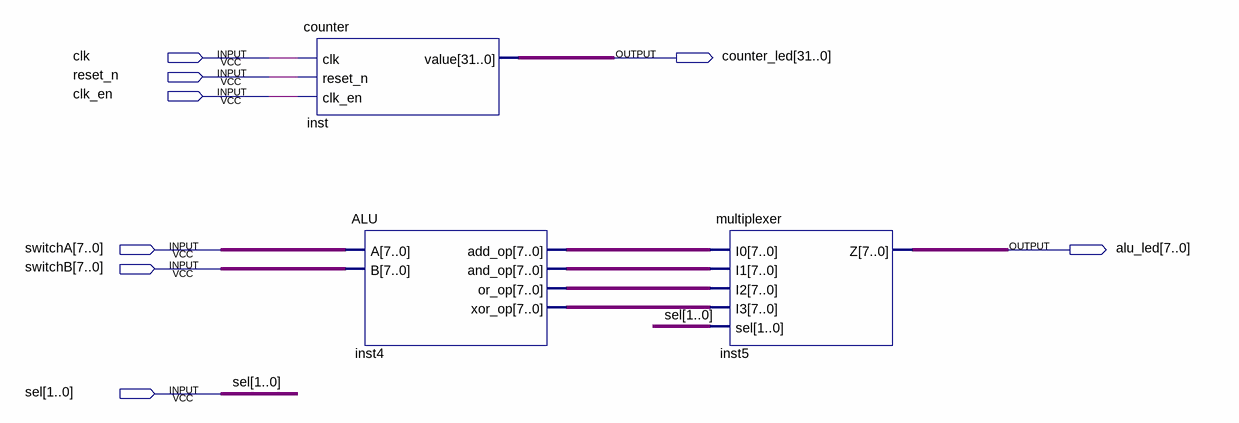
[diagram p0: schematic sheet]
// Quartus schematic Tutorial.bdf as structural Verilog: 3 symbols, 8 pins
module Tutorial (
  input  clk,
  input  reset_n,
  input  clk_en,
  input  [7:0] switchA,
  input  [7:0] switchB,
  input  [1:0] sel,
  output [31:0] counter_led,
  output [7:0] alu_led
);

  wire [7:0] inst4_add_op, inst4_and_op, inst4_or_op, inst4_xor_op;

  counter inst (.clk(clk), .reset_n(reset_n), .clk_en(clk_en), .value(counter_led));
  ALU inst4 (
    .A(switchA), .B(switchB), .add_op(inst4_add_op), .and_op(inst4_and_op), .or_op(inst4_or_op),
    .xor_op(inst4_xor_op));
  multiplexer inst5 (.I0(inst4_add_op), .I1(inst4_and_op), .I2(inst4_or_op), .I3(inst4_xor_op), .sel(sel), .Z(alu_led));
endmodule
